# Altium project MainBoard.PrjPcb
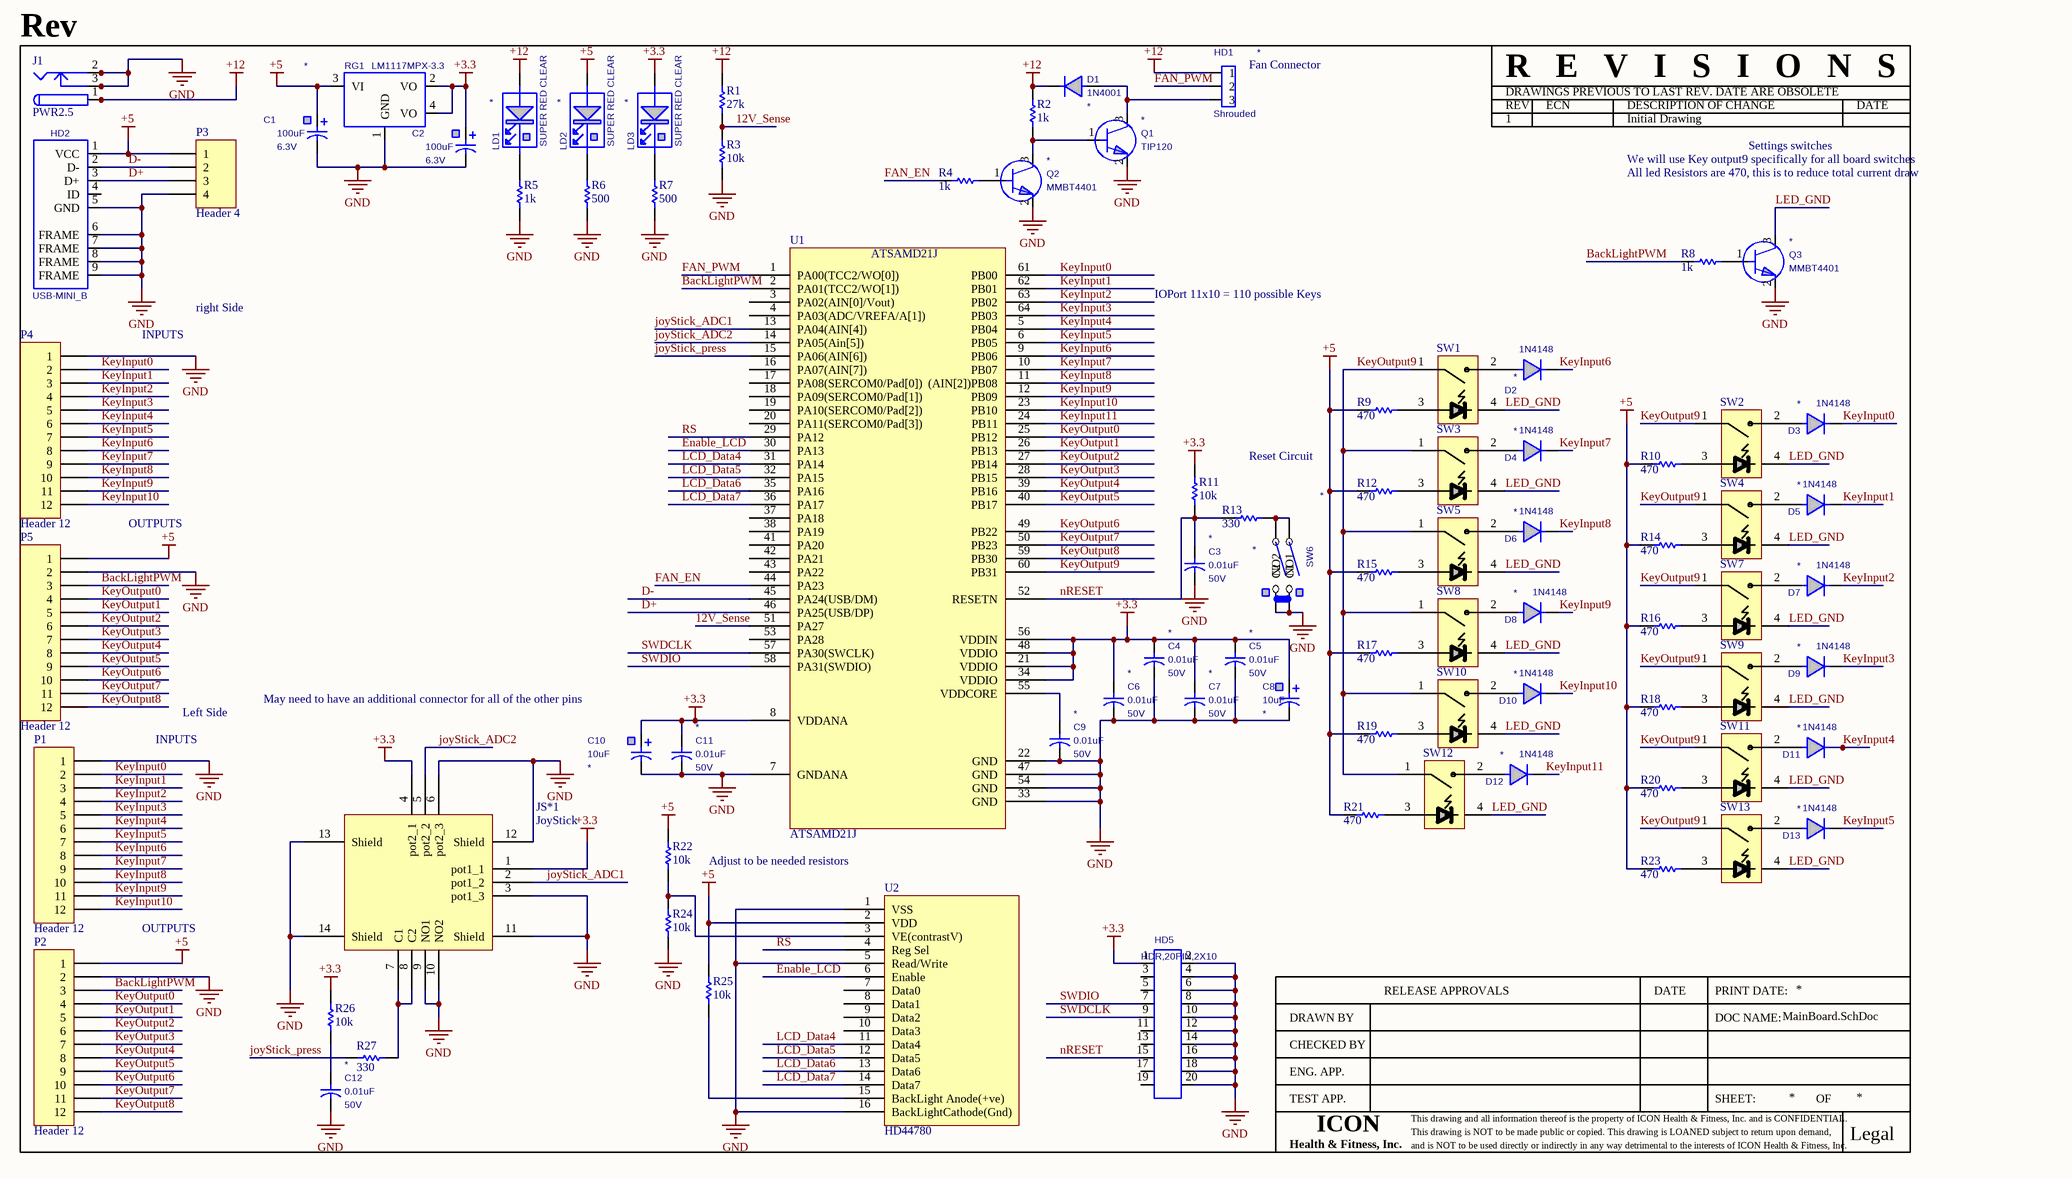
[diagram p0: MainBoard.SchDoc]
2 sheets, 133 parts. Net scope: global (net labels, ports and power ports of the same name join across sheets).
Board file: MainBoard.PcbDoc
Sheets:
  MainBoard.SchDoc
  VerticalKeyStrip.SchDoc

## Sheet MainBoard.SchDoc
size Legal

### Parts
(Parts that share a designator on the sheet are numbered #1, #2 ... from top to bottom, then left to right.)
C1  value 100uF  Voltage: 6.3V  [100uF_6.3V_Tant_0805]  (hidden comment: 100UF_TANT_6.3V_0805)
C2  value 100uF  Voltage: 6.3V  [100uF_6.3V_Tant_0805]  (hidden comment: 100UF_TANT_6.3V_0805)
C3  value 0.01uF  Voltage: 50V  [RC0603REFLOW-IPC]  (hidden comment: 0.01UF_0603REFLOW)
C4  value 0.01uF  Voltage: 50V  [RC0603REFLOW-IPC]  (hidden comment: 0.01UF_0603REFLOW)
C5  value 0.01uF  Voltage: 50V  [RC0603REFLOW-IPC]  (hidden comment: 0.01UF_0603REFLOW)
C6  value 0.01uF  Voltage: 50V  [RC0603REFLOW-IPC]  (hidden comment: 0.01UF_0603REFLOW)
C7  value 0.01uF  Voltage: 50V  [RC0603REFLOW-IPC]  (hidden comment: 0.01UF_0603REFLOW)
C8  value 10uF  [CAP_100RP42_6MMDIA]  (hidden comment: 10UF_RP_16V_100)
C9  value 0.01uF  Voltage: 50V  [RC0603REFLOW-IPC]  (hidden comment: 0.01UF_0603REFLOW)
C10  value 10uF  [CAP_100RP42_6MMDIA]  (hidden comment: 10UF_RP_16V_100)
C11  value 0.01uF  Voltage: 50V  [RC0603REFLOW-IPC]  (hidden comment: 0.01UF_0603REFLOW)
C12  value 0.01uF  Voltage: 50V  [RC0603REFLOW-IPC]  (hidden comment: 0.01UF_0603REFLOW)
D1  1N4001  [DIODE400/70/42]
D2#1  1N4148  [DIODE400/60/32]
D3  1N4148  [DIODE400/60/32]
D4  1N4148  [DIODE400/60/32]
D5  1N4148  [DIODE400/60/32]
D6  1N4148  [DIODE400/60/32]
D7  1N4148  [DIODE400/60/32]
D8  1N4148  [DIODE400/60/32]
D9  1N4148  [DIODE400/60/32]
D10  1N4148  [DIODE400/60/32]
D11  1N4148  [DIODE400/60/32]
D12  1N4148  [DIODE400/60/32]
D13  1N4148  [DIODE400/60/32]
HD1  HeaderType: Shrouded  [HDR3PIN100SHRD]  (hidden comment: HDR3PIN100SHRD)
HD2  USB-MINI_B  [HD_USB_MINI_B]
HD5  HDR,20PIN,2X10  [HDR-20PIN-2X10]
J1  PWR2.5  [KLD-0202]
JS*1  JoyStick  [JoyStick]
LD1  Color: SUPER RED CLEAR  [LED0603REFLOW-IPC-COLOR]  (hidden comment: 0603_RED)
LD2  Color: SUPER RED CLEAR  [LED0603REFLOW-IPC-COLOR]  (hidden comment: 0603_RED)
LD3  Color: SUPER RED CLEAR  [LED0603REFLOW-IPC-COLOR]  (hidden comment: 0603_RED)
P1  Header 12  [HDR1X12]
P2  Header 12  [HDR1X12]
P3  Header 4  [HDR1X4]
P4  Header 12  [HDR1X12]
P5  Header 12  [HDR1X12]
Q1  value TIP120  [SFM-T3/A6.6V]  (hidden comment: NPN_TRANSISTOR)
Q2  value MMBT4401  [SOT23-3]  (hidden comment: NPN_TRANSISTOR)
Q3#1  value MMBT4401  [SOT23-3]  (hidden comment: NPN_TRANSISTOR)
R1  value 27k  [RESC2012L]  (hidden comment: Res Semi)
R2  value 1k  [RESC2012L]  (hidden comment: Res Semi)
R3  value 10k  [RESC2012L]  (hidden comment: Res Semi)
R4  value 1k  [RESC2012L]  (hidden comment: Res Semi)
R5  value 1k  [RESC2012L]  (hidden comment: Res Semi)
R6  value 500  [RESC2012L]  (hidden comment: Res Semi)
R7  value 500  [RESC2012L]  (hidden comment: Res Semi)
R8#1  value 1k  [RESC2012L]  (hidden comment: Res Semi)
R9#1  value 470  [RESC2012L]  (hidden comment: Res Semi)
R10  value 470  [RESC2012L]  (hidden comment: Res Semi)
R11  value 10k  [RESC2012L]  (hidden comment: Res Semi)
R12  value 470  [RESC2012L]  (hidden comment: Res Semi)
R13  value 330  [RESC2012L]  (hidden comment: Res Semi)
R14  value 470  [RESC2012L]  (hidden comment: Res Semi)
R15  value 470  [RESC2012L]  (hidden comment: Res Semi)
R16  value 470  [RESC2012L]  (hidden comment: Res Semi)
R17  value 470  [RESC2012L]  (hidden comment: Res Semi)
R18  value 470  [RESC2012L]  (hidden comment: Res Semi)
R19  value 470  [RESC2012L]  (hidden comment: Res Semi)
R20  value 470  [RESC2012L]  (hidden comment: Res Semi)
R21  value 470  [RESC2012L]  (hidden comment: Res Semi)
R22  value 10k  [RESC2012L]  (hidden comment: Res Semi)
R23  value 470  [RESC2012L]  (hidden comment: Res Semi)
R24  value 10k  [RESC2012L]  (hidden comment: Res Semi)
R25  value 10k  [RESC2012L]  (hidden comment: Res Semi)
R26  value 10k  [RESC2012L]  (hidden comment: Res Semi)
R27  value 330  [RESC2012L]  (hidden comment: Res Semi)
RG1  value LM1117MPX-3.3  [SOT223REFLOW]  (hidden comment: LM1117SPX-3.3_SOT223)
SW1  CherrySwitch  [CherryMxSwitch]  (value not drawn)
SW2  CherrySwitch  [CherryMxSwitch]  (value not drawn)
SW3  CherrySwitch  [CherryMxSwitch]  (value not drawn)
SW4  CherrySwitch  [CherryMxSwitch]  (value not drawn)
SW5  CherrySwitch  [CherryMxSwitch]  (value not drawn)
SW6  SW-PCB-4P-6MM  [SW-PCB-4PIN]  (value not drawn)
SW7  CherrySwitch  [CherryMxSwitch]  (value not drawn)
SW8  CherrySwitch  [CherryMxSwitch]  (value not drawn)
SW9  CherrySwitch  [CherryMxSwitch]  (value not drawn)
SW10  CherrySwitch  [CherryMxSwitch]  (value not drawn)
SW11  CherrySwitch  [CherryMxSwitch]  (value not drawn)
SW12  CherrySwitch  [CherryMxSwitch]  (value not drawn)
SW13  CherrySwitch  [CherryMxSwitch]  (value not drawn)
U1  ATSAMD21J  [64A_N]
U2  HD44780  [HD44780]

### Nets
+3.3: C2.1(+) C4.1(pin1) C5.1(pin1) C6.1(pin1) C7.1(pin1) C8.1(pin1) C10.1(pin1) C11.1(pin1) HD5.1 JS*1.1(pot1_1) JS*1.4(pot2_1) LD3.2(ANODE) R11.2 R26.2 RG1.2(VO) RG1.4(VO) U1.8(VDDANA) U1.21(VDDIO) U1.34(VDDIO) U1.48(VDDIO) U1.56(VDDIN)
+5: C1.1(+) HD2.1(VCC) LD2.2(ANODE) P2.1 P3.1 P5.1 R9#1.1 R10.1 R12.1 R14.1 R15.1 R16.1 R17.1 R18.1 R19.1 R20.1 R21.1 R22.2 R23.1 R25.2 RG1.3(VI) U2.2(VDD)
+12: D1.1(CATHODE) HD1.1 J1.1 J1.1A J1.1B LD1.2(ANODE) R1.2 R2.2
GND: C1.2(-) C2.2(-) C3.2(pin2) C4.2(pin2) C5.2(pin2) C6.2(pin2) C7.2(pin2) C8.2(pin2) C9.2(pin2) C10.2(pin2) C11.2(pin2) C12.2(pin2) HD2.5(GND) HD2.6(FRAME) HD2.7(FRAME) HD2.8(FRAME) HD2.9(FRAME) HD5.2 HD5.4 HD5.6 HD5.8 HD5.10 HD5.12 HD5.14 HD5.16 HD5.18 HD5.20 J1.2 J1.2A J1.2B J1.3 J1.3A J1.3B JS*1.3(pot1_3) JS*1.6(pot2_3) JS*1.9(NO1) JS*1.10(NO2) JS*1.11(Shield) JS*1.12(Shield) JS*1.13(Shield) JS*1.14(Shield) P1.1 P2.2 P3.4 P4.1 P5.2 Q1.2(emitter) Q2.2(emitter) Q3#1.2(emitter) R3.1 R5.1 R6.1 R7.1 R24.1 RG1.1(GND) SW6.1(C1) SW6.2(C2) U1.7(GNDANA) U1.22(GND) U1.33(GND) U1.47(GND) U1.54(GND) U2.1(VSS) U2.5(Read/Write) U2.16(BackLightCathode(Gnd))
12V_Sense: R1.1 R3.2 U1.51(PA27)
BackLightPWM: P2.3 P5.3 R8#1.1 U1.2(PA01(TCC2/WO[1]))
D+: HD2.3(D+) P3.3 U1.46(PA25(USB/DP))
D-: HD2.2(D-) P3.2 U1.45(PA24(USB/DM))
Enable_LCD: U1.30(PA13) U2.6(Enable)
FAN_EN: R4.1 U1.44(PA23)
FAN_PWM: HD1.2 U1.1(PA00(TCC2/WO[0]))
joyStick_ADC1: JS*1.2(pot1_2) U1.13(PA04(AIN[4]))
joyStick_ADC2: JS*1.5(pot2_2) U1.14(PA05(Ain[5]))
joyStick_press: R27.2 U1.15(PA06(AIN[6]))
KeyInput0: D3.1(CATHODE) P1.2 P4.2 U1.61(PB00)
KeyInput1: D5.1(CATHODE) P1.3 P4.3 U1.62(PB01)
KeyInput2: D7.1(CATHODE) P1.4 P4.4 U1.63(PB02)
KeyInput3: D9.1(CATHODE) P1.5 P4.5 U1.64(PB03)
KeyInput4: D11.1(CATHODE) P1.6 P4.6 U1.5(PB04)
KeyInput5: D13.1(CATHODE) P1.7 P4.7 U1.6(PB05)
KeyInput6: D2#1.1(CATHODE) P1.8 P4.8 U1.9(PB06)
KeyInput7: D4.1(CATHODE) P1.9 P4.9 U1.10(PB07)
KeyInput8: D6.1(CATHODE) P1.10 P4.10 U1.11((AIN[2])PB08)
KeyInput9: D8.1(CATHODE) P1.11 P4.11 U1.12(PB09)
KeyInput10: D10.1(CATHODE) P1.12 P4.12 U1.23(PB10)
KeyInput11: D12.1(CATHODE) U1.24(PB11)
KeyOutput0: P2.4 P5.4 U1.25(PB12)
KeyOutput1: P2.5 P5.5 U1.26(PB13)
KeyOutput2: P2.6 P5.6 U1.27(PB14)
KeyOutput3: P2.7 P5.7 U1.28(PB15)
KeyOutput4: P2.8 P5.8 U1.39(PB16)
KeyOutput5: P2.9 P5.9 U1.40(PB17)
KeyOutput6: P2.10 P5.10 U1.49(PB22)
KeyOutput7: P2.11 P5.11 U1.50(PB23)
KeyOutput8: P2.12 P5.12 U1.59(PB30)
KeyOutput9: SW1.1 SW2.1 SW3.1 SW4.1 SW5.1 SW7.1 SW8.1 SW9.1 SW10.1 SW11.1 SW12.1 SW13.1 U1.60(PB31)
LCD_Data4: U1.31(PA14) U2.11(Data4)
LCD_Data5: U1.32(PA15) U2.12(Data5)
LCD_Data6: U1.35(PA16) U2.13(Data6)
LCD_Data7: U1.36(PA17) U2.14(Data7)
LED_GND: Q3#1.3(collector) SW1.4 SW2.4 SW3.4 SW4.4 SW5.4 SW7.4 SW8.4 SW9.4 SW10.4 SW11.4 SW12.4 SW13.4
nRESET: C3.1(pin1) HD5.15 R11.1 R13.1 U1.52(RESETN)
RS: U1.29(PA12) U2.4(Reg_Sel)
SWDCLK: HD5.9 U1.57(PA30(SWCLK))
SWDIO: HD5.7 U1.58(PA31(SWDIO))
NetC9_1: C9.1(pin1) U1.55(VDDCORE)
NetC12_1: C12.1(pin1) R26.1
NetD1_2: D1.2(ANODE) HD1.3 Q1.3(collector)
NetD2#1_2: D2#1.2(ANODE) SW1.2
NetD3_2: D3.2(ANODE) SW2.2
NetD4_2: D4.2(ANODE) SW3.2
NetD5_2: D5.2(ANODE) SW4.2
NetD6_2: D6.2(ANODE) SW5.2
NetD7_2: D7.2(ANODE) SW7.2
NetD8_2: D8.2(ANODE) SW8.2
NetD9_2: D9.2(ANODE) SW9.2
NetD10_2: D10.2(ANODE) SW10.2
NetD11_2: D11.2(ANODE) SW11.2
NetD12_2: D12.2(ANODE) SW12.2
NetD13_2: D13.2(ANODE) SW13.2
NetJS*1_7: JS*1.7(C1) JS*1.8(C2) R27.1
NetLD1_1: LD1.1(CATHODE) R5.2
NetLD2_1: LD2.1(CATHODE) R6.2
NetLD3_1: LD3.1(CATHODE) R7.2
NetQ1_1: Q1.1(base) Q2.3(collector) R2.1
NetQ2_1: Q2.1(base) R4.2
NetQ3#1_1: Q3#1.1(base) R8#1.2
NetR9#1_2: R9#1.2 SW1.3
NetR10_2: R10.2 SW2.3
NetR12_2: R12.2 SW3.3
NetR13_2: R13.2 SW6.3(NO2) SW6.4(NO1)
NetR14_2: R14.2 SW4.3
NetR15_2: R15.2 SW5.3
NetR16_2: R16.2 SW7.3
NetR17_2: R17.2 SW8.3
NetR18_2: R18.2 SW9.3
NetR19_2: R19.2 SW10.3
NetR20_2: R20.2 SW11.3
NetR21_2: R21.2 SW12.3
NetR22_1: R22.1 R24.2 U2.3(VE(contrastV))
NetR23_2: R23.2 SW13.3
NetR25_1: R25.1 U2.15(BackLight_Anode(+ve))

Not connected (* = marked no-connect by the designer): HD1 4; HD2 4(ID) 10 11; HD5 3 5 11 13 17 19; U1 3(PA02(AIN[0]/Vout)) 4(PA03(ADC/VREFA/A[1])) 16(PA07(AIN[7])) 17(PA08(SERCOM0/Pad[0])) 18(PA09(SERCOM0/Pad[1])) 19(PA10(SERCOM0/Pad[2])) 20(PA11(SERCOM0/Pad[3])) 37(PA18) 38(PA19) 41(PA20) 42(PA21) 43(PA22) 53(PA28); U2 7(Data0) 8(Data1) 9(Data2) 10(Data3)

### Notes on the sheet
- (near HD1) Fan Connector
- We will use Key output9 specifically for all board switches
- Settings switches
- All led Resistors are 470, this is to reduce total current draw
- IOPort 11x10 = 110 possible Keys
- INPUTS
- right Side
- Reset Circuit
- OUTPUTS
- May need to have an additional connector for all of the other pins
- Left Side
- Adjust to be needed resistors
- Rev
- R   E   V   I   S   I   O   N   S
- DRAWINGS PREVIOUS TO LAST REV. DATE ARE OBSOLETE
- REV
- 1
- ECN
- DESCRIPTION OF CHANGE
- Initial Drawing
- DATE
- CHECKED BY
- DRAWN BY
- RELEASE APPROVALS
- DOC NAME:
- PRINT DATE:
- TEST APP.
- ENG. APP.
- SHEET:
- OF
- Health & Fitness, Inc.
- ICON
- This drawing and all information thereof is the property of ICON Health & Fitness, Inc. and is CONFIDENTIAL.
- This drawing is NOT to be made public or copied. This drawing is LOANED subject to return upon demand,
- and is NOT to be used directly or indirectly in any way detrimental to the interests of ICON Health & Fitness, Inc.
- Legal

### Library data of the parts
C1 C2 = 100UF_TANT_6.3V_0805: Capacitor; CapType: General Purpose; Tolerance: +/- 20%; Polarity: Polar; Vendor: VISHAY: 298D107X06R3P2T or Exact Equivalent; Composition: Tantalum; Package: 0805; CheckedBy: Sam Rhoufiry; Leads: *; Datasheet: \\langley\electronics\accel_lib\datasheets\VISHAY_100UF_6.3V_TANT_0805_298d.pdf; ModifyDate: 06/30/2009 09:22:39; ComponentLink1Description: Datasheet; ComponentLink1URL: \\langley\electronics\accel_lib\datasheets\VISHAY_100UF_6.3V_TANT_0805_298d.pdf; HelpURL: \\langley\electronics\accel_lib\datasheets\VISHAY_100UF_6.3V_TANT_0805_298d.pdf; ComponentType: Capacitor
C3-C7 C9 C11 C12 = 0.01UF_0603REFLOW: Capacitor; CapType: X7R; Tolerance: +/- 10%; Polarity: Non-Polar; Vendor: Kemet: C0603C103K5RACTU; Composition: Ceramic; Package: 0603; LeadSpacing: *; CheckedBy: *; ModifyDate: 04/06/2006 14:59:41; Leads: *; Datasheet: *; ComponentLink1Description: Datasheet; ComponentType: Capacitor; DNS: *
C8 C10 = 10UF_RP_16V_100: Capacitor; Voltage: 16V; Leads: Radial; Polarity: Polar; LeadSpacing: 0.1 in.; Tolerance: +/- 20%; Vendor: Nichicon: UVR1V100MDA; PackageOutlineLayer: PackageOutline; IDF_COMP: 1; DNS: *; Composition: Electrolytic; CheckedBy: B. Lyon; ModifyDate: 04/06/2006 14:59:47; Package: *; CapType: *; Datasheet: G:\accel_lib\datasheets\capalumelectrobipolarradial-nichicon.pdf; ComponentHeight: 475mil; ComponentLink1Description: Datasheet; ComponentLink1URL: G:\accel_lib\datasheets\capalumelectrobipolarradial-nichicon.pdf; HelpURL: G:\accel_lib\datasheets\capalumelectrobipolarradial-nichicon.pdf; ComponentType: Capacitor
D1 = 1N4001: Diode; LeadSpacing: 0.4 in.; Wattage: 1W; Vendor: Motorola: 1N4001/D; DiodeType: Standard Recovery Rectifier; Voltage: 50V; Amperage: 1A; Leads: Axial; DNS: *; Value: 1N4001; Package: DO-41; CheckedBy: Mourly Thov; Datasheet: G:\accel_lib\datasheets\1N4001-7_motorola.pdf; ModifyDate: 08/27/2007 16:11:27; ComponentLink1Description: Datasheet; ComponentLink1URL: G:\accel_lib\datasheets\1N4001-7_motorola.pdf; HelpURL: G:\accel_lib\datasheets\1N4001-7_motorola.pdf; ComponentType: Diode
D2#1 D3-D13 = 5283: Diode, 1N4148, 75V, 0.4 in., DO-35, 150mA, Switching, 500mW, Any; LeadSpacing: 0.4 in.; Reference: g:\accel_lib\datasheets\1N914-916-4148-Fairchild.PDF; plIDX: 5283; DNS: *; Value: 1N4148; Package: DO-35; Wattage: 500mW; Vendor: Any; DiodeType: Switching; Voltage: 75V; Amperage: 150mA; CheckedBy: B. Lyon; ModifyDate: 08/27/2007 16:11:30; ComponentType: Diode; Cost: 0.0038; ComponentLink4URL: https://pdm.iconfitness.com/PDM/EBOM/PartsMaintenance/PartsMaintenance.aspx?Editplidx=5283; ComponentLink4Description: PDM Parts Maintenance
HD1 = 1767: Header, 0.100 in., 3 pin Pins, Shrouded, AMP: 644486-3; PackageOutlineLayer: PackageOutline; IDF_COMP: 1; plIDX: 1767; LeadSpacing: 0.100 in.; Pins: 3 pin; Vendor: AMP: 644486-3; CheckedBy: Grunt Mcfunkwhistle; Datasheet: g:\accel_lib\datasheets\MTA-AMP.pdf; ModifyDate: 10/23/2008 15:32:40; ComponentHeight: 625mil; ComponentType: Header; DNS: *; Cost: 0.055; ComponentLink4URL: https://pdm.iconfitness.com/PDM/EBOM/PartsMaintenance/PartsMaintenance.aspx?Editplidx=1767; ComponentLink4Description: PDM Parts Maintenance
HD2 = USB-MINI_B: Header; LeadSpacing: NA; HeaderType: USB Type B Mini receptacle, with mounting posts; Vendor: Hirose: UX60-MB-5ST or CMUSB-5BFMX-01-C; IDF_COMP: 1; Pins: 5 pin; DNS: *; CheckedBy: T. Hayes; Datasheet: G:\accel_lib\datasheets\USB-Hirose.pdf; ComponentHeight: 156mil; ModifyDate: 10/12/10; Value: *; ComponentLink1Description: Datasheet; ComponentLink1URL: G:\accel_lib\datasheets\USB-Hirose.pdf; ComponentType: Header
HD5 = HDR,20PIN,2X10: IDF_COMP: 1; ComponentHeight: 625mil; ModifyDate: 07/30/2008 17:40:30; Value: *; ComponentLink1Description: Datasheet; ComponentType: Header
J1 = PWR2.5: Low Voltage Power Supply Connector; Published: 17-Dec-2003; DatasheetDocument: 09-May-2002; Publisher: Altium Limited; ComponentLink1Description: Manufacturer Link; ComponentLink1URL: http://domino.kycon.com/internet/Products.html
LD1-LD3 = 0603_RED: LED; Value: {Value}; Shape: Rectangle; LEDType: Diffused; Vendor: Lite-on:LTST-C190KRKT or equivalent; PackageOutlineLayer: PackageOutline; IDF_COMP: 1; Package: 0603; CheckedBy: Elton John; Datasheet: G:\accel_lib\datasheets\LTST-C190KRKT.pdf; ModifyDate: 02/08/2007 16:42:04; ComponentHeight: 32mil; ComponentLink1Description: Datasheet; ComponentLink1URL: G:\accel_lib\datasheets\LTST-C190KRKT.pdf; HelpURL: G:\accel_lib\datasheets\LTST-C190KRKT.pdf; ComponentType: LED; DNS: *
P1 P2 P4 P5 = Header 12: Header, 12-Pin; LatestRevisionDate: 17-Jul-2002; LatestRevisionNote: Re-released for DXP Platform.; Publisher: Altium Limited
P3 = Header 4: Header, 4-Pin; LatestRevisionDate: 17-Jul-2002; LatestRevisionNote: Re-released for DXP Platform.; Publisher: Altium Limited
Q1 Q2 Q3#1 = 265442: Transistor, MMBT4401, 40V, SOT23-3, 500mA, NPN, Transistor, On Semi: MMBT4401LT1; plIDX: 265442; CheckedBy: gdeguzman; DNS: *; ComponentType: Transistor; CreatedBy: Mike Tyger; LastUpdatedBy: Mike Tyger; Cost: 0.0094; Voltage: 40V; Package: SOT23-3; Amperage: 500mA; TransistorType: NPN; ChipType: Transistor; Vendor: On Semi: MMBT4401LT1; ComponentLink4URL: https://pdm.iconfitness.com/PDM/EBOM/PartsMaintenance/PartsMaintenance.aspx?Editplidx=265442; ComponentLink4Description: PDM Parts Maintenance
R1-R7 R8#1 R9#1 R10-R27 = Res Semi: Semiconductor Resistor; Published: 8-Jun-2000; LatestRevisionDate: 17-Jul-2002; LatestRevisionNote: Re-released for DXP Platform.; PackageReference: AXIAL-0.5; Publisher: Altium Limited
RG1 = LM1117SPX-3.3_SOT223: Regulator; Voltage: 3.3V; Amperage: 800mA; RegulatorType: LDO; Vendor: National: LM1117MPX-3.3; PackageOutlineLayer: PackageOutline; IDF_COMP: 1; Package: SOT223; CheckedBy: B. Lyon; Datasheet: G:\accel_lib\datasheets\LM1117-national.pdf; ComponentHeight: 63mil; ModifyDate: 07/10/2007 16:11:35; ComponentLink1Description: Datasheet; ComponentLink1URL: G:\accel_lib\datasheets\LM1117-national.pdf; HelpURL: G:\accel_lib\datasheets\LM1117-national.pdf; ComponentType: Regulator; DNS: *
SW1-SW5 SW7-SW13 = CherrySwitch: Cherry MX Switch layout
SW6 = SW-PCB-4P-6MM: Switch; Vendor: Panasonic: EVQ-PAC04M; SwitchType: momentary on; Circuit: SPST; Actuator: push-button; Package: PCB mount; CheckedBy: *; Datasheet: *; ComponentLink1Description: Datasheet; ComponentType: Switch; DNS: *; Value: *

## Sheet VerticalKeyStrip.SchDoc
size A
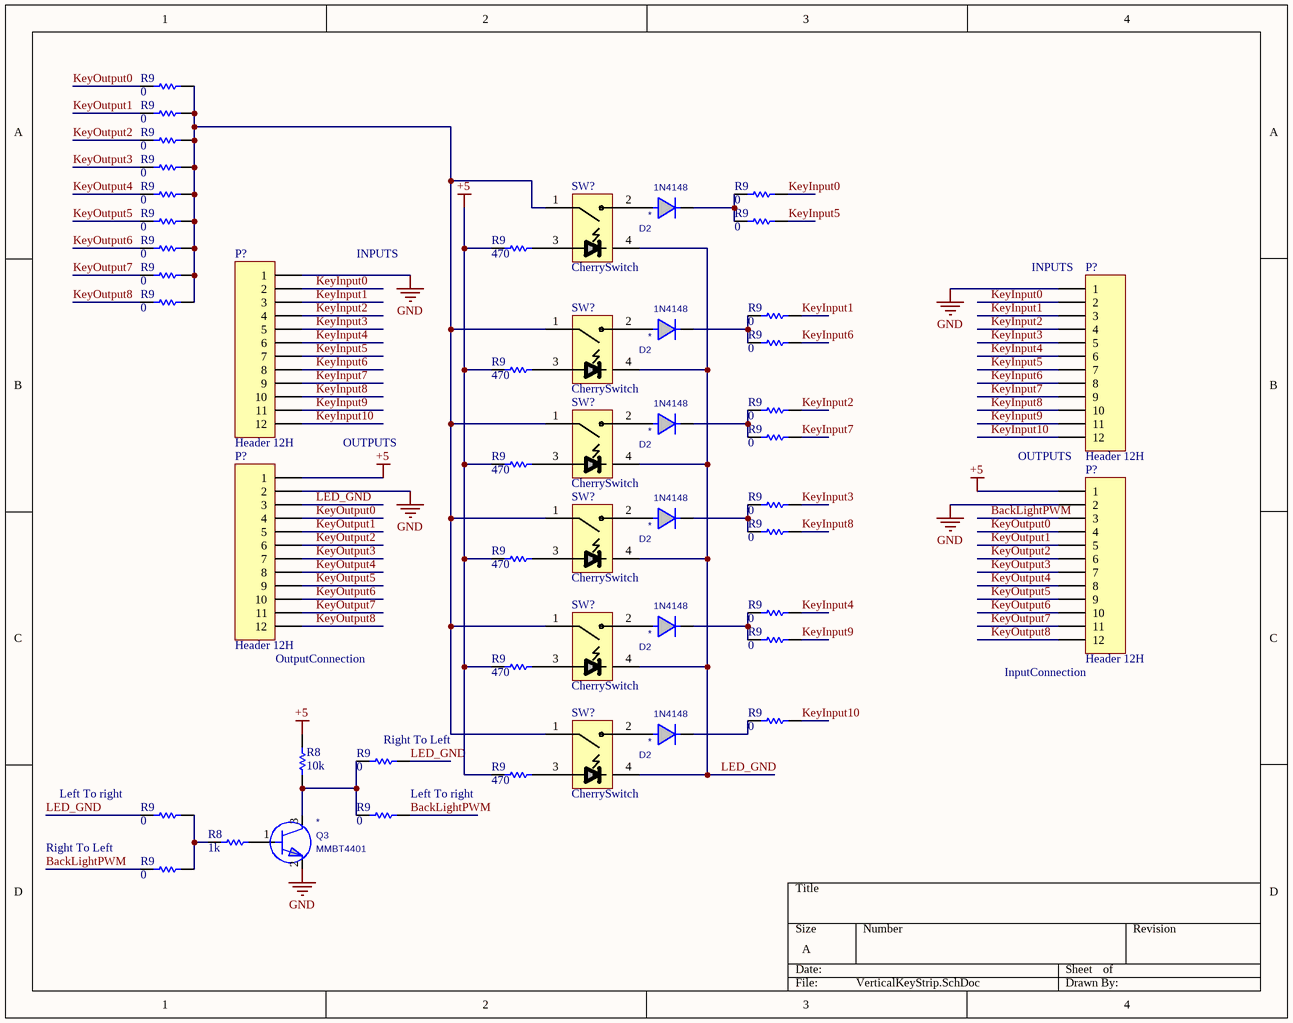
[diagram p1: VerticalKeyStrip.SchDoc]

### Parts
(Parts that share a designator on the sheet are numbered #1, #2 ... from top to bottom, then left to right.)
D2#2  1N4148  [DIODE400/60/32]
D2#3  1N4148  [DIODE400/60/32]
D2#4  1N4148  [DIODE400/60/32]
D2#5  1N4148  [DIODE400/60/32]
D2#6  1N4148  [DIODE400/60/32]
D2#7  1N4148  [DIODE400/60/32]
P?#1  Header 12H  [HDR1X12H]
P?#2  Header 12H  [HDR1X12H]
P?#3  Header 12H  [HDR1X12H]
P?#4  Header 12H  [HDR1X12H]
Q3#2  value MMBT4401  [SOT23-3]  (hidden comment: NPN_TRANSISTOR)
R8#2  value 10k  [RESC2012L]  (hidden comment: Res Semi)
R8#3  value 1k  [RESC2012L]  (hidden comment: Res Semi)
R9#2  value 0  [RESC2012L]  (hidden comment: Res Semi)
R9#3  value 0  [RESC2012L]  (hidden comment: Res Semi)
R9#4  value 0  [RESC2012L]  (hidden comment: Res Semi)
R9#5  value 0  [RESC2012L]  (hidden comment: Res Semi)
R9#6  value 0  [RESC2012L]  (hidden comment: Res Semi)
R9#7  value 0  [RESC2012L]  (hidden comment: Res Semi)
R9#8  value 0  [RESC2012L]  (hidden comment: Res Semi)
R9#9  value 0  [RESC2012L]  (hidden comment: Res Semi)
R9#10  value 0  [RESC2012L]  (hidden comment: Res Semi)
R9#11  value 470  [RESC2012L]  (hidden comment: Res Semi)
R9#12  value 0  [RESC2012L]  (hidden comment: Res Semi)
R9#13  value 0  [RESC2012L]  (hidden comment: Res Semi)
R9#14  value 0  [RESC2012L]  (hidden comment: Res Semi)
R9#15  value 0  [RESC2012L]  (hidden comment: Res Semi)
R9#16  value 470  [RESC2012L]  (hidden comment: Res Semi)
R9#17  value 0  [RESC2012L]  (hidden comment: Res Semi)
R9#18  value 0  [RESC2012L]  (hidden comment: Res Semi)
R9#19  value 470  [RESC2012L]  (hidden comment: Res Semi)
R9#20  value 0  [RESC2012L]  (hidden comment: Res Semi)
R9#21  value 0  [RESC2012L]  (hidden comment: Res Semi)
R9#22  value 470  [RESC2012L]  (hidden comment: Res Semi)
R9#23  value 0  [RESC2012L]  (hidden comment: Res Semi)
R9#24  value 0  [RESC2012L]  (hidden comment: Res Semi)
R9#25  value 470  [RESC2012L]  (hidden comment: Res Semi)
R9#26  value 0  [RESC2012L]  (hidden comment: Res Semi)
R9#27  value 0  [RESC2012L]  (hidden comment: Res Semi)
R9#28  value 470  [RESC2012L]  (hidden comment: Res Semi)
R9#29  value 0  [RESC2012L]  (hidden comment: Res Semi)
R9#30  value 0  [RESC2012L]  (hidden comment: Res Semi)
R9#31  value 0  [RESC2012L]  (hidden comment: Res Semi)
SW?#1  CherrySwitch  [CherryMxSwitch]
SW?#2  CherrySwitch  [CherryMxSwitch]
SW?#3  CherrySwitch  [CherryMxSwitch]
SW?#4  CherrySwitch  [CherryMxSwitch]
SW?#5  CherrySwitch  [CherryMxSwitch]
SW?#6  CherrySwitch  [CherryMxSwitch]

### Nets
+5: P?#3.1 P?#4.1 R8#2.2 R9#11.1 R9#16.1 R9#19.1 R9#22.1 R9#25.1 R9#28.1
GND: P?#1.1 P?#2.1 P?#3.2 P?#4.2 Q3#2.2(emitter)
BackLightPWM: P?#4.3 R9#30.2 R9#31.1
KeyInput0: P?#1.2 P?#2.2 R9#7.2
KeyInput1: P?#1.3 P?#2.3 R9#14.2
KeyInput2: P?#1.4 P?#2.4 R9#17.2
KeyInput3: P?#1.5 P?#2.5 R9#20.2
KeyInput4: P?#1.6 P?#2.6 R9#23.2
KeyInput5: P?#1.7 P?#2.7 R9#9.2
KeyInput6: P?#1.8 P?#2.8 R9#15.2
KeyInput7: P?#1.9 P?#2.9 R9#18.2
KeyInput8: P?#1.10 P?#2.10 R9#21.2
KeyInput9: P?#1.11 P?#2.11 R9#24.2
KeyInput10: P?#1.12 P?#2.12 R9#26.2
KeyOutput0: P?#3.4 P?#4.4 R9#2.1
KeyOutput1: P?#3.5 P?#4.5 R9#3.1
KeyOutput2: P?#3.6 P?#4.6 R9#4.1
KeyOutput3: P?#3.7 P?#4.7 R9#5.1
KeyOutput4: P?#3.8 P?#4.8 R9#6.1
KeyOutput5: P?#3.9 P?#4.9 R9#8.1
KeyOutput6: P?#3.10 P?#4.10 R9#10.1
KeyOutput7: P?#3.11 P?#4.11 R9#12.1
KeyOutput8: P?#3.12 P?#4.12 R9#13.1
LED_GND: P?#3.3 R9#27.2 R9#29.1 SW?#1.4 SW?#2.4 SW?#3.4 SW?#4.4 SW?#5.4 SW?#6.4
NetD2#2_1: D2#2.1(CATHODE) R9#7.1 R9#9.1
NetD2#2_2: D2#2.2(ANODE) SW?#1.2
NetD2#3_1: D2#3.1(CATHODE) R9#14.1 R9#15.1
NetD2#3_2: D2#3.2(ANODE) SW?#2.2
NetD2#4_1: D2#4.1(CATHODE) R9#17.1 R9#18.1
NetD2#4_2: D2#4.2(ANODE) SW?#3.2
NetD2#5_1: D2#5.1(CATHODE) R9#20.1 R9#21.1
NetD2#5_2: D2#5.2(ANODE) SW?#4.2
NetD2#6_1: D2#6.1(CATHODE) R9#23.1 R9#24.1
NetD2#6_2: D2#6.2(ANODE) SW?#5.2
NetD2#7_1: D2#7.1(CATHODE) R9#26.1
NetD2#7_2: D2#7.2(ANODE) SW?#6.2
NetQ3#2_1: Q3#2.1(base) R8#3.2
NetQ3#2_3: Q3#2.3(collector) R8#2.1 R9#27.1 R9#30.1
NetR8#3_1: R8#3.1 R9#29.2 R9#31.2
NetR9#2_2: R9#2.2 R9#3.2 R9#4.2 R9#5.2 R9#6.2 R9#8.2 R9#10.2 R9#12.2 R9#13.2 SW?#1.1 SW?#2.1 SW?#3.1 SW?#4.1 SW?#5.1 SW?#6.1
NetR9#11_2: R9#11.2 SW?#1.3
NetR9#16_2: R9#16.2 SW?#2.3
NetR9#19_2: R9#19.2 SW?#3.3
NetR9#22_2: R9#22.2 SW?#4.3
NetR9#25_2: R9#25.2 SW?#5.3
NetR9#28_2: R9#28.2 SW?#6.3

### Notes on the sheet
- INPUTS
- (near P?#2) INPUTS
- OUTPUTS
- (near P?#2) OUTPUTS
- (near P?#3) OutputConnection
- (near P?#4) InputConnection
- (near R9#27) Right To Left
- (near R9#29) Left To right
- (near R9#30) Left To right
- (near R9#31) Right To Left

### Library data of the parts
D2#2-D2#7 = 5283: as D2#1 on sheet MainBoard; DNS: *; Value: 1N4148; Package: DO-35; Wattage: 500mW; Vendor: Any; DiodeType: Switching; Voltage: 75V; Amperage: 150mA; CheckedBy: B. Lyon; ModifyDate: 08/27/2007 16:11:30; ComponentType: Diode; Cost: 0.0038; ComponentLink4URL: https://pdm.iconfitness.com/PDM/EBOM/PartsMaintenance/PartsMaintenance.aspx?Editplidx=5283; ComponentLink4Description: PDM Parts Maintenance
P?#1-P?#4 = Header 12H: Header, 12-Pin, Right Angle; LatestRevisionDate: 17-Jul-2002; LatestRevisionNote: Re-released for DXP Platform.; Publisher: Altium Limited
Q3#2 = 265442: as Q1 on sheet MainBoard; CheckedBy: gdeguzman; DNS: *; ComponentType: Transistor; CreatedBy: Mike Tyger; LastUpdatedBy: Mike Tyger; Cost: 0.0094; Voltage: 40V; Package: SOT23-3; Amperage: 500mA; TransistorType: NPN; ChipType: Transistor; Vendor: On Semi: MMBT4401LT1; ComponentLink4URL: https://pdm.iconfitness.com/PDM/EBOM/PartsMaintenance/PartsMaintenance.aspx?Editplidx=265442; ComponentLink4Description: PDM Parts Maintenance
R8#2 R8#3 R9#2-R9#31 = Res Semi: Semiconductor Resistor; Published: 8-Jun-2000; LatestRevisionDate: 17-Jul-2002; LatestRevisionNote: Re-released for DXP Platform.; PackageReference: AXIAL-0.5; Publisher: Altium Limited
SW?#1-SW?#6 = CherrySwitch: Cherry MX Switch layout

## Nets that join several sheets
+5: MainBoard (22 pins), VerticalKeyStrip (9 pins)
GND: MainBoard (65 pins), VerticalKeyStrip (5 pins)
BackLightPWM: MainBoard (P2.3 P5.3 R8#1.1 U1.2), VerticalKeyStrip (P?#4.3 R9#30.2 R9#31.1)
KeyInput0: MainBoard (D3.1 P1.2 P4.2 U1.61), VerticalKeyStrip (P?#1.2 P?#2.2 R9#7.2)
KeyInput1: MainBoard (D5.1 P1.3 P4.3 U1.62), VerticalKeyStrip (P?#1.3 P?#2.3 R9#14.2)
KeyInput2: MainBoard (D7.1 P1.4 P4.4 U1.63), VerticalKeyStrip (P?#1.4 P?#2.4 R9#17.2)
KeyInput3: MainBoard (D9.1 P1.5 P4.5 U1.64), VerticalKeyStrip (P?#1.5 P?#2.5 R9#20.2)
KeyInput4: MainBoard (D11.1 P1.6 P4.6 U1.5), VerticalKeyStrip (P?#1.6 P?#2.6 R9#23.2)
KeyInput5: MainBoard (D13.1 P1.7 P4.7 U1.6), VerticalKeyStrip (P?#1.7 P?#2.7 R9#9.2)
KeyInput6: MainBoard (D2#1.1 P1.8 P4.8 U1.9), VerticalKeyStrip (P?#1.8 P?#2.8 R9#15.2)
KeyInput7: MainBoard (D4.1 P1.9 P4.9 U1.10), VerticalKeyStrip (P?#1.9 P?#2.9 R9#18.2)
KeyInput8: MainBoard (D6.1 P1.10 P4.10 U1.11), VerticalKeyStrip (P?#1.10 P?#2.10 R9#21.2)
KeyInput9: MainBoard (D8.1 P1.11 P4.11 U1.12), VerticalKeyStrip (P?#1.11 P?#2.11 R9#24.2)
KeyInput10: MainBoard (D10.1 P1.12 P4.12 U1.23), VerticalKeyStrip (P?#1.12 P?#2.12 R9#26.2)
KeyOutput0: MainBoard (P2.4 P5.4 U1.25), VerticalKeyStrip (P?#3.4 P?#4.4 R9#2.1)
KeyOutput1: MainBoard (P2.5 P5.5 U1.26), VerticalKeyStrip (P?#3.5 P?#4.5 R9#3.1)
KeyOutput2: MainBoard (P2.6 P5.6 U1.27), VerticalKeyStrip (P?#3.6 P?#4.6 R9#4.1)
KeyOutput3: MainBoard (P2.7 P5.7 U1.28), VerticalKeyStrip (P?#3.7 P?#4.7 R9#5.1)
KeyOutput4: MainBoard (P2.8 P5.8 U1.39), VerticalKeyStrip (P?#3.8 P?#4.8 R9#6.1)
KeyOutput5: MainBoard (P2.9 P5.9 U1.40), VerticalKeyStrip (P?#3.9 P?#4.9 R9#8.1)
KeyOutput6: MainBoard (P2.10 P5.10 U1.49), VerticalKeyStrip (P?#3.10 P?#4.10 R9#10.1)
KeyOutput7: MainBoard (P2.11 P5.11 U1.50), VerticalKeyStrip (P?#3.11 P?#4.11 R9#12.1)
KeyOutput8: MainBoard (P2.12 P5.12 U1.59), VerticalKeyStrip (P?#3.12 P?#4.12 R9#13.1)
LED_GND: MainBoard (13 pins), VerticalKeyStrip (9 pins)